# Altium project ISA8_Ethernet.PrjPcb
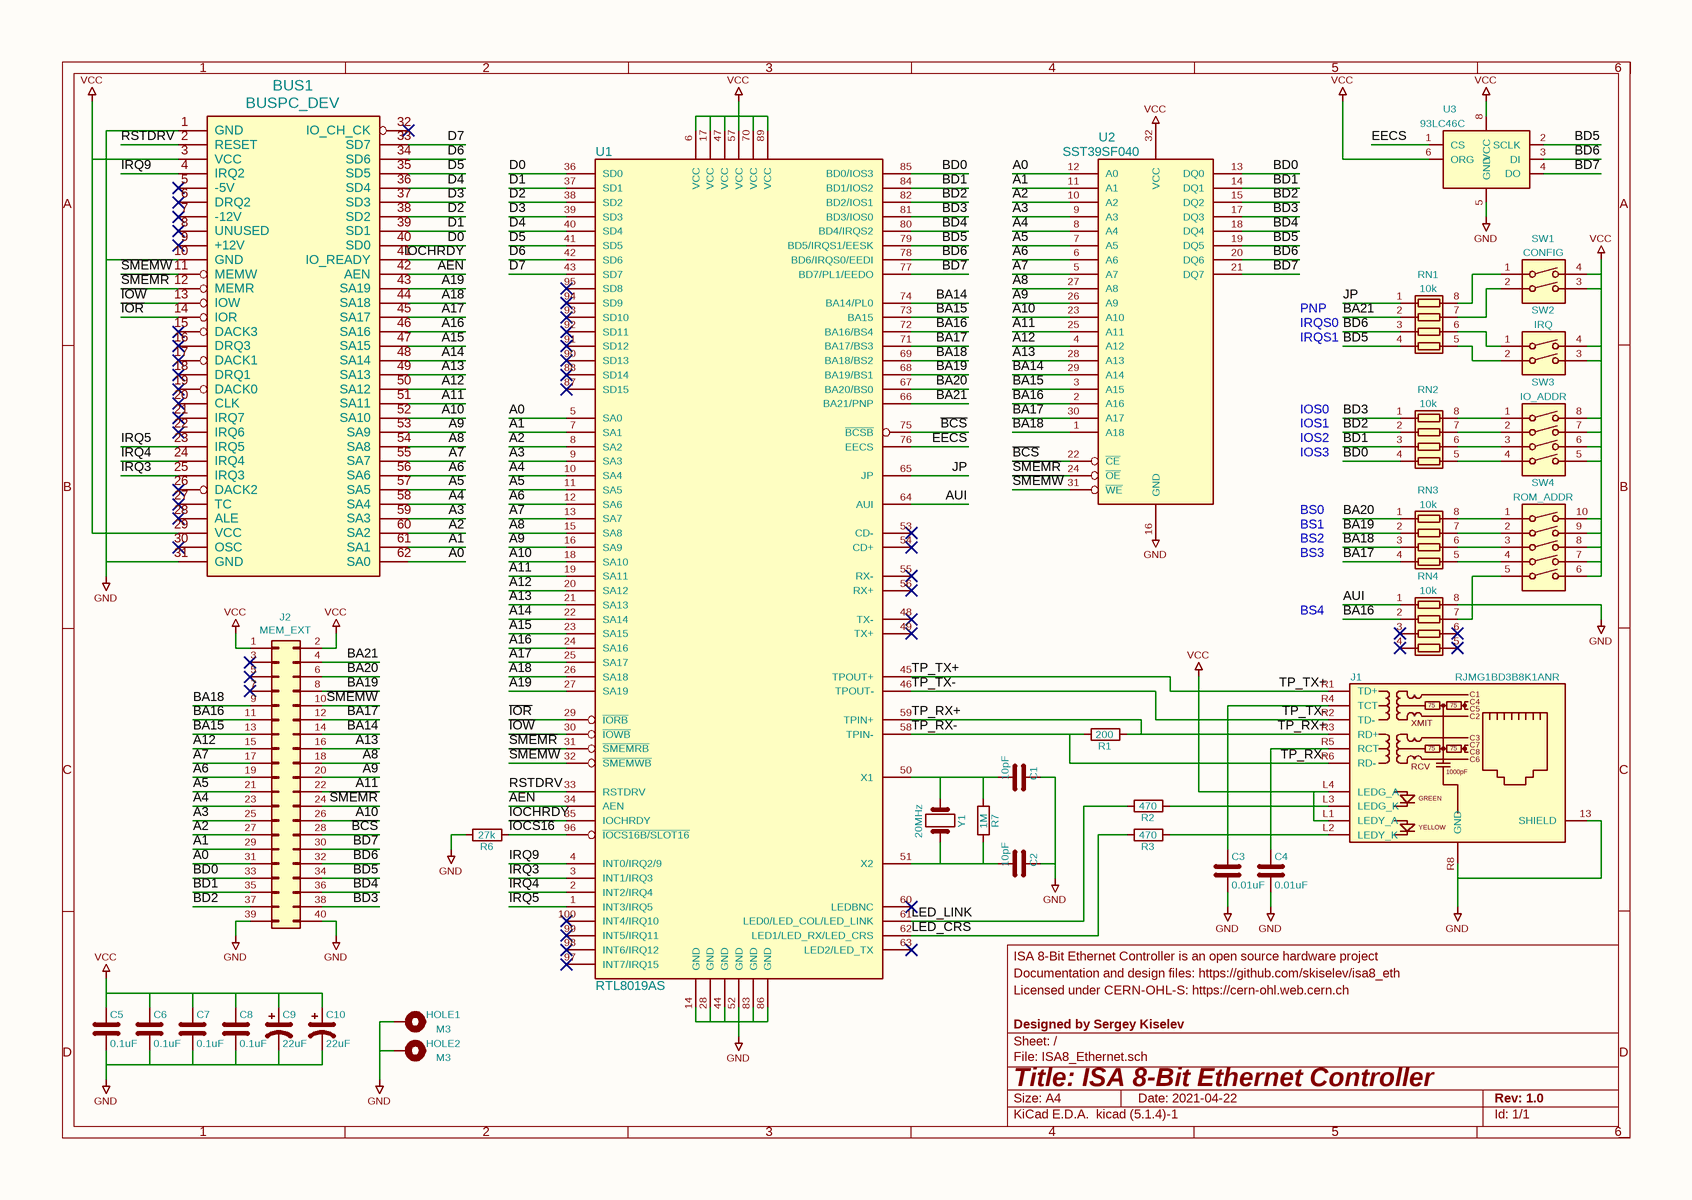
[diagram p0: ISA8_Ethernet.SchDoc]
1 sheet, 32 parts. Net scope: global (net labels, ports and power ports of the same name join across sheets).
Board file: ISA8_Ethernet.PcbDoc

## Sheet ISA8_Ethernet.SchDoc
size 297 x 210 mm

### Parts
BUS1  BUSPC_DEV  [Conn_Edge_PCB_ISA8]
C1  10pF  [C_0603_1608Metric_Pad1.08x0.95mm_HandSolder]
C2  10pF  [C_0603_1608Metric_Pad1.08x0.95mm_HandSolder]
C3  0.01uF  [C_0603_1608Metric_Pad1.08x0.95mm_HandSolder]
C4  0.01uF  [C_0603_1608Metric_Pad1.08x0.95mm_HandSolder]
C5  0.1uF  [C_0603_1608Metric_Pad1.08x0.95mm_HandSolder]
C6  0.1uF  [C_0603_1608Metric_Pad1.08x0.95mm_HandSolder]
C7  0.1uF  [C_0603_1608Metric_Pad1.08x0.95mm_HandSolder]
C8  0.1uF  [C_0603_1608Metric_Pad1.08x0.95mm_HandSolder]
C9  22uF  [CP_EIA-3528-15_AVX-H_Pad1.50x2.35mm_HandSolder]
C10  22uF  [CP_EIA-3528-15_AVX-H_Pad1.50x2.35mm_HandSolder]
HOLE1  M3  [MountingHole_3.2mm_M3_Pad_Via]
HOLE2  M3  [MountingHole_3.2mm_M3_Pad_Via]
J1  RJMG1BD3B8K1ANR  [RJ45_Amphenol_RJMG1BD3B8K1ANR]
J2  MEM_EXT  [Conn_Pin_Header_20x2_2.54mm]
R1  200  [R_0603_1608Metric_Pad0.98x0.95mm_HandSolder]
R2  470  [R_0603_1608Metric_Pad0.98x0.95mm_HandSolder]
R3  470  [R_0603_1608Metric_Pad0.98x0.95mm_HandSolder]
R6  27k  [R_0603_1608Metric_Pad0.98x0.95mm_HandSolder]
R7  1M  [R_0603_1608Metric_Pad0.98x0.95mm_HandSolder]
RN1  10k  [R_Array_Convex_4x0603]
RN2  10k  [R_Array_Convex_4x0603]
RN3  10k  [R_Array_Convex_4x0603]
RN4  10k  [R_Array_Convex_4x0603]
SW1  CONFIG  [Switch_DIP_2_Positions]
SW2  IRQ  [Switch_DIP_2_Positions]
SW3  IO_ADDR  [Switch_DIP_4_Positions]
SW4  ROM_ADDR  [Switch_DIP_5_Positions]
U1  RTL8019AS  [IC_PQFP-100_14x20mm_P0.65mm_Hand_Soldering]
U2  SST39SF040  [Socket_DIP32_600]
U3  93LC46C  [SO-8_3.9x4.9mm_P1.27mm]
Y1  20MHz  [Crystal_HC-49U_Vert]

### Nets
GND: BUS1.1(GND) BUS1.10(GND) BUS1.31(GND) C1.1 C2.1 C3.2 C4.2 C5.2 C6.2 C7.2 C8.2 C9.2 C10.2 HOLE1.1 HOLE2.1 J1.13(SHIELD) J1.R8(GND) J2.39(Pin_39) J2.40(Pin_40) R6.1 RN4.8(R1.2) U1.14(GND) U1.28(GND) U1.44(GND) U1.52(GND) U1.83(GND) U1.86(GND) U2.16(GND) U3.5(GND)
VCC: BUS1.3(VCC) BUS1.29(VCC) C5.1 C6.1 C7.1 C8.1 C9.1 C10.1 J1.L1(LEDY_A) J1.L4(LEDG_A) J2.1(Pin_1) J2.2(Pin_2) SW1.3 SW1.4 SW2.3 SW2.4 SW3.5 SW3.6 SW3.7 SW3.8 SW4.6 SW4.7 SW4.8 SW4.9 SW4.10 U1.6(VCC) U1.17(VCC) U1.47(VCC) U1.57(VCC) U1.70(VCC) U1.89(VCC) U2.32(VCC) U3.6(ORG) U3.8(VCC)
A0: BUS1.62(SA0) J2.31(Pin_31) U1.5(SA0) U2.12(A0)
A1: BUS1.61(SA1) J2.29(Pin_29) U1.7(SA1) U2.11(A1)
A2: BUS1.60(SA2) J2.27(Pin_27) U1.8(SA2) U2.10(A2)
A3: BUS1.59(SA3) J2.25(Pin_25) U1.9(SA3) U2.9(A3)
A4: BUS1.58(SA4) J2.23(Pin_23) U1.10(SA4) U2.8(A4)
A5: BUS1.57(SA5) J2.21(Pin_21) U1.11(SA5) U2.7(A5)
A6: BUS1.56(SA6) J2.19(Pin_19) U1.12(SA6) U2.6(A6)
A7: BUS1.55(SA7) J2.17(Pin_17) U1.13(SA7) U2.5(A7)
A8: BUS1.54(SA8) J2.18(Pin_18) U1.15(SA8) U2.27(A8)
A9: BUS1.53(SA9) J2.20(Pin_20) U1.16(SA9) U2.26(A9)
A10: BUS1.52(SA10) J2.26(Pin_26) U1.18(SA10) U2.23(A10)
A11: BUS1.51(SA11) J2.22(Pin_22) U1.19(SA11) U2.25(A11)
A12: BUS1.50(SA12) J2.15(Pin_15) U1.20(SA12) U2.4(A12)
A13: BUS1.49(SA13) J2.16(Pin_16) U1.21(SA13) U2.28(A13)
A14: BUS1.48(SA14) U1.22(SA14)
A15: BUS1.47(SA15) U1.23(SA15)
A16: BUS1.46(SA16) U1.24(SA16)
A17: BUS1.45(SA17) U1.25(SA17)
A18: BUS1.44(SA18) U1.26(SA18)
A19: BUS1.43(SA19) U1.27(SA19)
AEN: BUS1.42(AEN) U1.34(AEN)
AUI: RN4.1(R1.1) U1.64(AUI)
~{BCS}: J2.28(Pin_28) U1.75(~{BCSB}) U2.22(~{CE})
BA14: J2.14(Pin_14) U1.74(BA14/PL0) U2.29(A14)
BA15: J2.13(Pin_13) U1.73(BA15) U2.3(A15)
BA16: J2.11(Pin_11) RN4.2(R2.1) U1.72(BA16/BS4) U2.2(A16)
BA17: J2.12(Pin_12) RN3.4(R4.1) U1.71(BA17/BS3) U2.30(A17)
BA18: J2.9(Pin_9) RN3.3(R3.1) U1.69(BA18/BS2) U2.1(A18)
BA19: J2.8(Pin_8) RN3.2(R2.1) U1.68(BA19/BS1)
BA20: J2.6(Pin_6) RN3.1(R1.1) U1.67(BA20/BS0)
BA21: J2.4(Pin_4) RN1.2(R2.1) U1.66(BA21/PNP)
BD0: J2.33(Pin_33) RN2.4(R4.1) U1.85(BD0/IOS3) U2.13(DQ0)
BD1: J2.35(Pin_35) RN2.3(R3.1) U1.84(BD1/IOS2) U2.14(DQ1)
BD2: J2.37(Pin_37) RN2.2(R2.1) U1.82(BD2/IOS1) U2.15(DQ2)
BD3: J2.38(Pin_38) RN2.1(R1.1) U1.81(BD3/IOS0) U2.17(DQ3)
BD4: J2.36(Pin_36) U1.80(BD4/IRQS2) U2.18(DQ4)
BD5: J2.34(Pin_34) RN1.4(R4.1) U1.79(BD5/IRQS1/EESK) U2.19(DQ5) U3.2(SCLK)
BD6: J2.32(Pin_32) RN1.3(R3.1) U1.78(BD6/IRQS0/EEDI) U2.20(DQ6) U3.3(DI)
BD7: J2.30(Pin_30) U1.77(BD7/PL1/EEDO) U2.21(DQ7) U3.4(DO)
D0: BUS1.40(SD0) U1.36(SD0)
D1: BUS1.39(SD1) U1.37(SD1)
D2: BUS1.38(SD2) U1.38(SD2)
D3: BUS1.37(SD3) U1.39(SD3)
D4: BUS1.36(SD4) U1.40(SD4)
D5: BUS1.35(SD5) U1.41(SD5)
D6: BUS1.34(SD6) U1.42(SD6)
D7: BUS1.33(SD7) U1.43(SD7)
EECS: U1.76(EECS) U3.1(CS)
~{IOCS16}: R6.2 U1.96(~{IOCS16B/SLOT16})
~{IOR}: BUS1.14(IOR) U1.29(~{IORB})
~{IOW}: BUS1.13(IOW) U1.30(~{IOWB})
IOCHRDY: BUS1.41(IO_READY) U1.35(IOCHRDY)
IRQ3: BUS1.25(IRQ3) U1.3(INT1/IRQ3)
IRQ4: BUS1.24(IRQ4) U1.2(INT2/IRQ4)
IRQ5: BUS1.23(IRQ5) U1.1(INT3/IRQ5)
IRQ9: BUS1.4(IRQ2) U1.4(INT0/IRQ2/9)
JP: RN1.1(R1.1) U1.65(JP)
LED_CRS: R3.2 U1.62(LED1/LED_RX/LED_CRS)
LED_LINK: R2.2 U1.61(LED0/LED_COL/LED_LINK)
RSTDRV: BUS1.2(RESET) U1.33(RSTDRV)
~{SMEMR}: BUS1.12(MEMR) J2.24(Pin_24) U1.31(~{SMEMRB}) U2.24(~{OE})
~{SMEMW}: BUS1.11(MEMW) J2.10(Pin_10) U1.32(~{SMEMWB}) U2.31(~{WE})
TP_RX+: J1.R3(RD+) R1.1 U1.59(TPIN+)
TP_RX-: J1.R6(RD-) R1.2 U1.58(TPIN-)
TP_TX+: J1.R1(TD+) U1.45(TPOUT+)
TP_TX-: J1.R2(TD-) U1.46(TPOUT-)
NetC1_2: C1.2 R7.1 U1.50(X1) Y1.1
NetC2_2: C2.2 R7.2 U1.51(X2) Y1.2
NetC3_1: C3.1 J1.R4(TCT)
NetC4_1: C4.1 J1.R5(RCT)
NetJ1_L2: J1.L2(LEDY_K) R3.1
NetJ1_L3: J1.L3(LEDG_K) R2.1
NetRN1_5: RN1.5(R4.2) SW2.2
NetRN1_6: RN1.6(R3.2) SW2.1
NetRN1_7: RN1.7(R2.2) SW1.2
NetRN1_8: RN1.8(R1.2) SW1.1
NetRN2_5: RN2.5(R4.2) SW3.4
NetRN2_6: RN2.6(R3.2) SW3.3
NetRN2_7: RN2.7(R2.2) SW3.2
NetRN2_8: RN2.8(R1.2) SW3.1
NetRN3_5: RN3.5(R4.2) SW4.4
NetRN3_6: RN3.6(R3.2) SW4.3
NetRN3_7: RN3.7(R2.2) SW4.2
NetRN3_8: RN3.8(R1.2) SW4.1
NetRN4_7: RN4.7(R2.2) SW4.5

Not connected (* = marked no-connect by the designer): BUS1 5(-5V)* 6(DRQ2)* 7(-12V)* 8(UNUSED)* 9(+12V)* 15(DACK3)* 16(DRQ3)* 17(DACK1)* 18(DRQ1)* 19(DACK0)* 20(CLK)* 21(IRQ7)* 22(IRQ6)* 26(DACK2)* 27(TC)* 28(ALE)* 30(OSC)* 32(IO_CH_CK)*; J1 R7(NC); J2 3(Pin_3)* 5(Pin_5)* 7(Pin_7)*; RN4 3(R3.1)* 4(R4.1)* 5(R4.2)* 6(R3.2)*; U1 48(TX-)* 49(TX+)* 53(CD-)* 54(CD+)* 55(RX-)* 56(RX+)* 60(LEDBNC)* 63(LED2/LED_TX)* 87(SD15)* 88(SD14)* 90(SD13)* 91(SD12)* 92(SD11)* 93(SD10)* 94(SD9)* 95(SD8)* 97(INT7/IRQ15)* 98(INT6/IRQ12)* 99(INT5/IRQ11)* 100(INT4/IRQ10)*; U3 7(NC)

### Notes on the sheet
- IRQS0
- IRQS1
- PNP
- IOS0
- IOS1
- IOS2
- IOS3
- BS3
- BS2
- BS1
- BS0
- BS4
- 1
- 2
- 3
- 4
- 5
- 6
- A
- B
- C
- Licensed under CERN-OHL-S: https://cern-ohl.web.cern.ch
- Documentation and design files: https://github.com/skiselev/isa8_eth
- ISA 8-Bit Ethernet Controller is an open source hardware project
- D
- Title: ISA 8-Bit Ethernet Controller
- File: ISA8_Ethernet.sch
- Sheet: /
- Designed by Sergey Kiselev
- KiCad E.D.A.  kicad (5.1.4)-1
- Size: A4
- Date: 2021-04-22
- Rev: 1.0
- Id: 1/1
- (in symbol RJ45_Amphenol_RJMG1BD3B8K1ANR) C1; 75; C4; C5; XMIT; C2; C3; C7; C8; RCV; C6; 1000pF; GREEN; YELLOW

### Library data of the parts
C1-C8 = C: Footprint: Capacitor_SMD:C_0603_1608Metric_Pad1.08x0.95mm_HandSolder
  C1 C2: Value: 10pF
  C3 C4: Value: 0.01uF
  C5-C8: Value: 0.1uF
C9 C10 = CP1: Value: 22uF; Footprint: Capacitor_Tantalum_SMD:CP_EIA-3528-15_AVX-H_Pad1.50x2.35mm_HandSolder
HOLE1 HOLE2 = MountingHole_Pad: Value: M3; Footprint: MountingHole:MountingHole_3.2mm_M3_Pad_Via
J1 = RJ45_Amphenol_RJMG1BD3B8K1ANR: Value: RJMG1BD3B8K1ANR; Footprint: Connector_RJ:RJ45_Amphenol_RJMG1BD3B8K1ANR
J2 = Conn_02x20_Odd_Even: Value: MEM_EXT; Footprint: My_Components:Conn_Pin_Header_20x2_2.54mm
R1-R3 R6 R7 = R: Footprint: Resistor_SMD:R_0603_1608Metric_Pad0.98x0.95mm_HandSolder
  R1: Value: 200
  R2 R3: Value: 470
  R6: Value: 27k
  R7: Value: 1M
RN1-RN4 = R_Pack04: Value: 10k; Footprint: Resistor_SMD:R_Array_Convex_4x0603
SW1 SW2 = SW_DIP_x02: Footprint: My_Components:Switch_DIP_2_Positions
  SW1: Value: CONFIG
  SW2: Value: IRQ
SW3 = SW_DIP_x04: Value: IO_ADDR; Footprint: My_Components:Switch_DIP_4_Positions
SW4 = SW_DIP_x05: Value: ROM_ADDR; Footprint: My_Components:Switch_DIP_5_Positions
U3 = 93LCxxC: Value: 93LC46C; Footprint: Package_SO:SO-8_3.9x4.9mm_P1.27mm
Y1 = Crystal: Value: 20MHz; Footprint: My_Components:Crystal_HC-49U_Vert
BUS1 = BUSPC_DEV: Value: BUSPC_DEV; Footprint: My_Components:Conn_Edge_PCB_ISA8
U1 = RTL8019AS: Value: RTL8019AS; Footprint: My_Components:IC_PQFP-100_14x20mm_P0.65mm_Hand_Soldering
U2 = SST39SF040: Value: SST39SF040; Footprint: My_Components:Socket_DIP32_600